# Altium schematic sheet Controller Top Sheet.SchDoc
size A
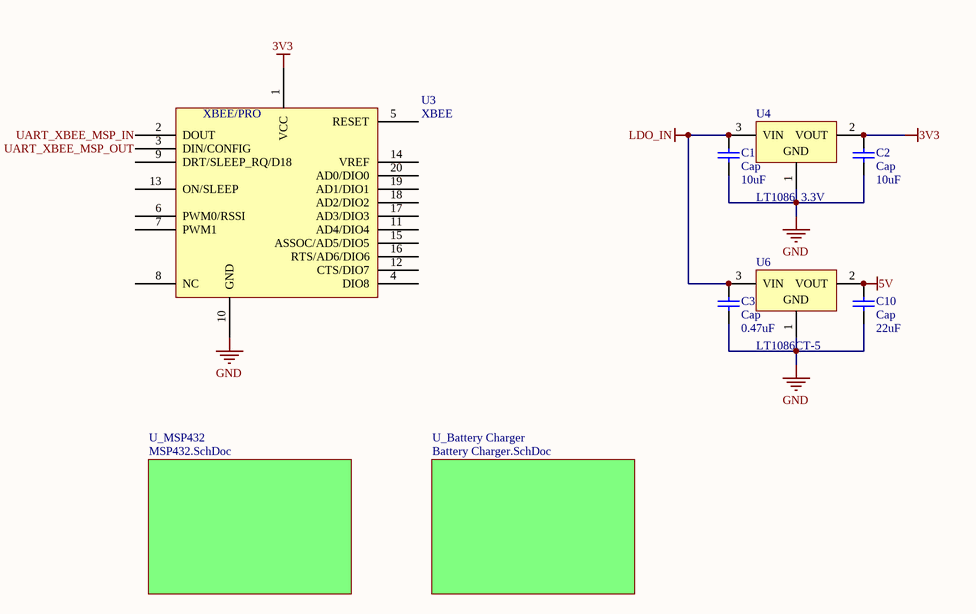
[diagram p0: Controller Top Sheet.SchDoc]

## Parts
C1  Cap  value 10uF  [RAD-0.3]
C2  Cap  value 10uF  [RAD-0.3]
C3  Cap  value 0.47uF  [RAD-0.3]
C10  Cap  value 22uF  [RAD-0.3]
U3  XBEE  [XBEE/PRO]
U4  LT1086  3.3V  [TO-220]
U6  LT1086CT-5  [LT-T-3]

## Sub-sheets
U_Battery Charger = Battery Charger.SchDoc: no entries
U_MSP432 = MSP432.SchDoc: no entries

## Nets
3V3: C2.2 U3.1(VCC) U4.2(VOUT)
5V: C10.2 U6.2(VOUT)
GND: C1.1 C2.1 C3.1 C10.1 U3.10(GND) U4.1(GND) U6.1(GND)
LDO_IN: C1.2 C3.2 U4.3(VIN) U6.3(VIN)
UART_XBEE_MSP_IN: U3.2(DOUT)
UART_XBEE_MSP_OUT: U3.3(DIN/CONFIG)

Not connected (* = marked no-connect by the designer): U3 4(DIO8) 5(RESET) 6(PWM0/RSSI) 7(PWM1) 8(NC) 9(DRT/SLEEP_RQ/D18) 11(AD4/DIO4) 12(CTS/DIO7) 13(ON/SLEEP) 14(VREF) 15(ASSOC/AD5/DIO5) 16(RTS/AD6/DIO6) 17(AD3/DIO3) 18(AD2/DIO2) 19(AD1/DIO1) 20(AD0/DIO0)

## Notes on the sheet
- (in symbol XBEE) XBEE/PRO

## Library data of the parts
C1-C3 C10 = Cap: Capacitor; Published: 8-Jun-2000; LatestRevisionDate: 17-Jul-2002; LatestRevisionNote: Re-released for DXP Platform.; PackageReference: RAD-0.3; Publisher: Altium Limited; PackageDescription: Radial Cap, Thru-Hole; 2 Leads; 0.3 in Pin Spacing
U6 = LT1086CT-5: 1.5 A Low Dropout Positive Regulator, 2.55 to 25 V Vin, 5 V Vout, 3-pin FM (T-3), 0 to 150 degC; Manufacturer: Linear Technology; Discrete Pass Element: no; Dropout Voltage(V): 1.3; Iout(mA): 1500; Isupply(mA): 5; Number of Outputs: 1; Output Voltage: 5 V; PSRR(dB): 68; Vin Max(V): 25; Vin Min(V): 2.55; DatasheetVersion: Rev. F; PackageVersion: Jun-10; PackageReference: T-3; PackageDescription: 3-Pin Plastic TO-220, Body 10.2235 x 4.3815 mm, Pitch 2.54 mm; Supplier 1: Digi-Key; Supplier Part Number 1: LT1086CT-5-ND; Supplier 2: Newark; Supplier Part Number 2: 57M1554; RoHS: FALSE; Mounting Technology: Through Hole; PartNumber: LT1086CT-5; ComponentLink1Description: Manufacturer URL; ComponentLink1URL: http://www.linear.com/; ComponentLink2Description: Datasheet; ComponentLink2URL: http://cds.linear.com/docs/en/datasheet/1086ffs.pdf; ComponentLink3Description: Package Specification; ComponentLink3URL: http://cds.linear.com/docs/en/packaging/TO-220_3_05-08-1420.pdf